# EAGLE schematic board (EAGLE 9.6.2)
CNAME: JTAG adapter board; CREVISION: V1.4
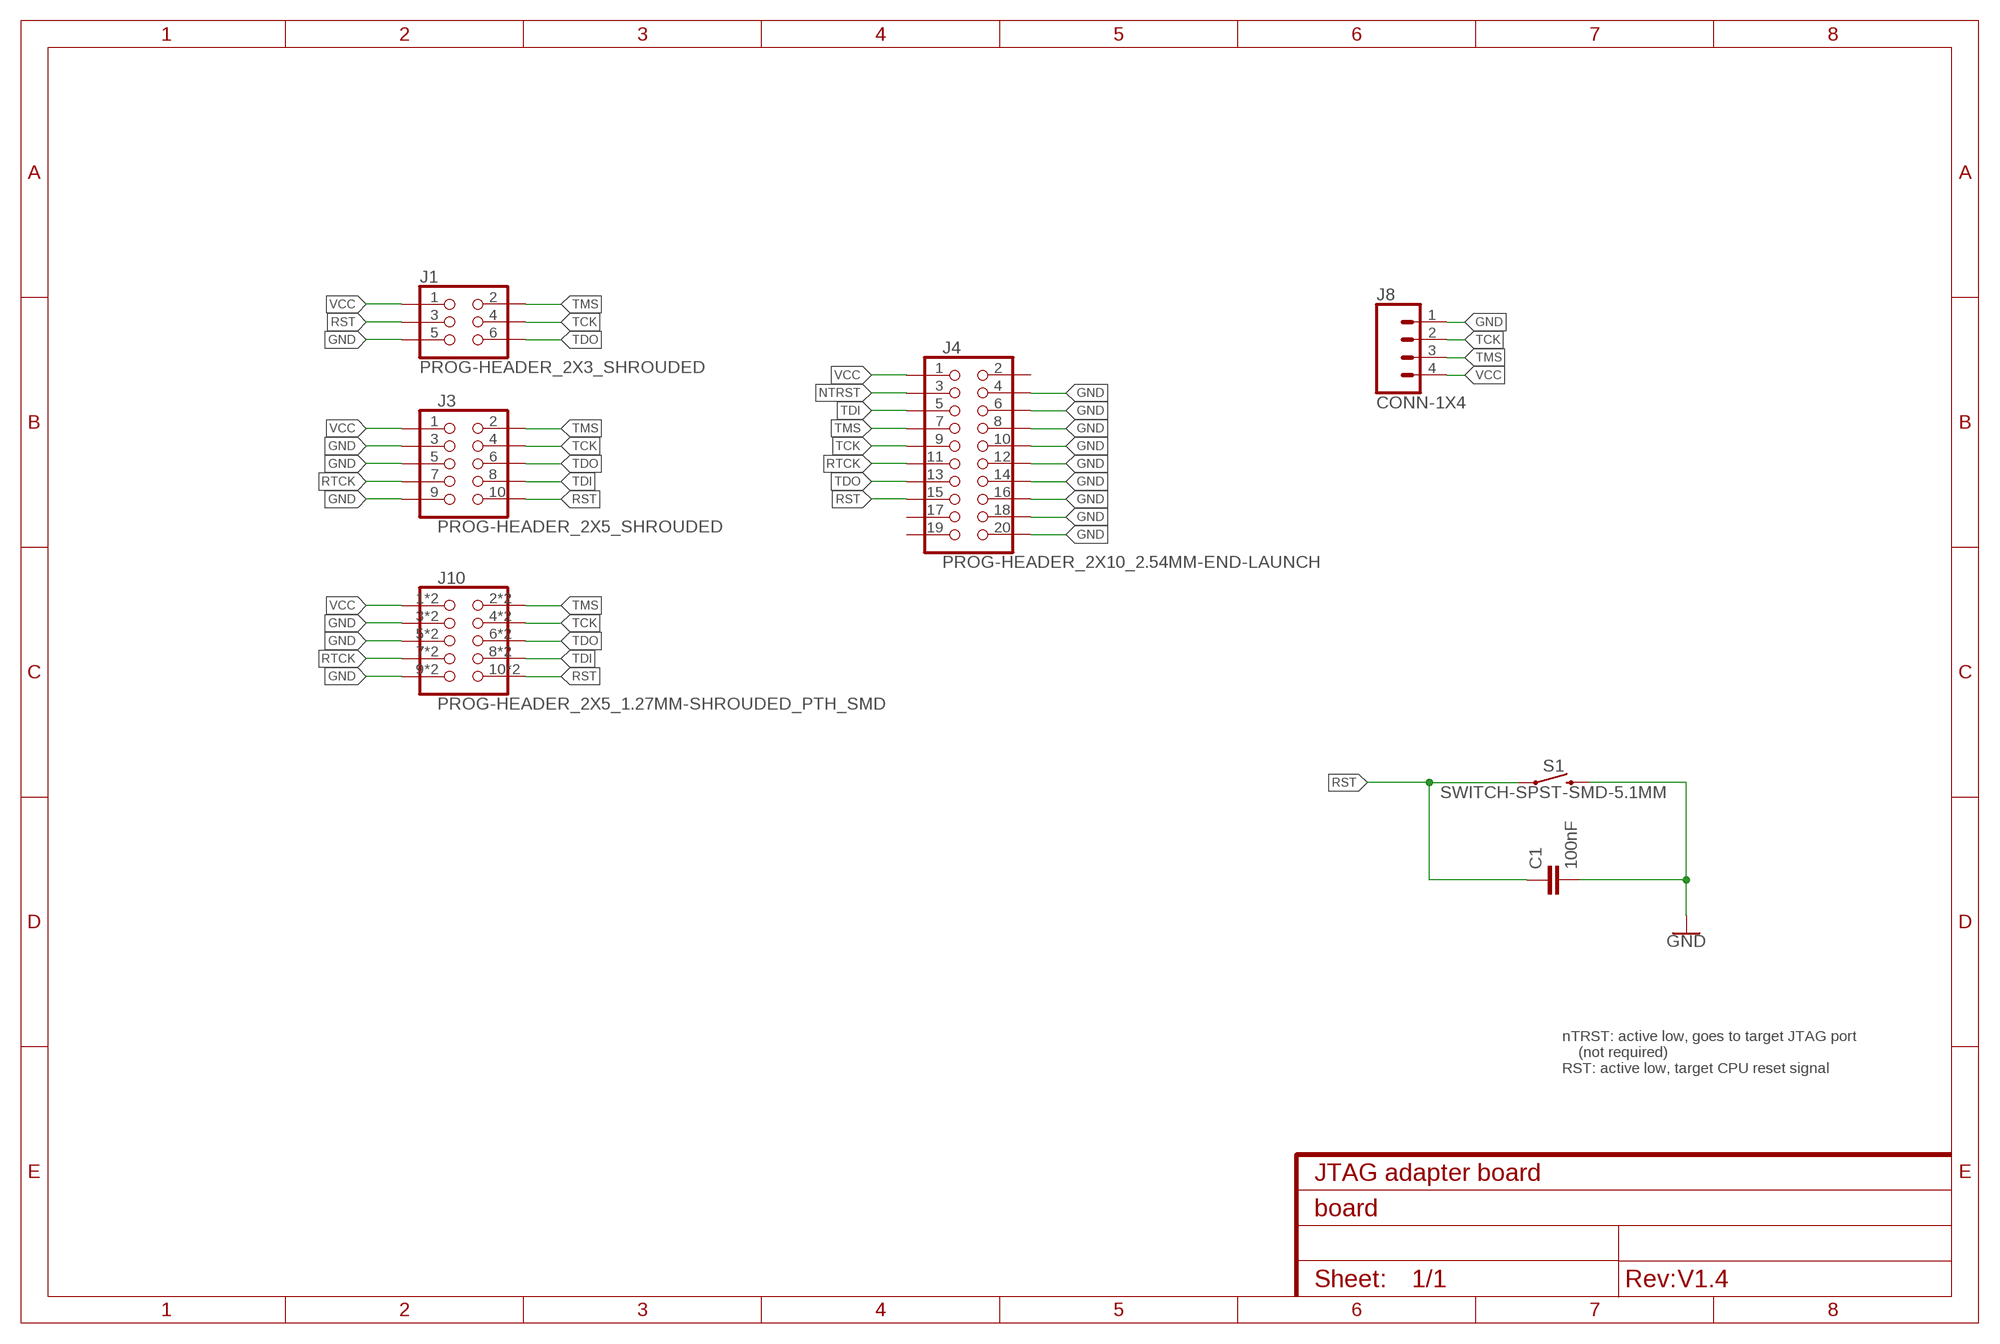
[diagram p0: schematic, sheet 1]

## Parts
C1  100nF  C-NON-POLC0603  [C0603]
J1  PROG-HEADER_2X3_SHROUDED  [2X3-2.54MM-SHROUDED]
J3  PROG-HEADER_2X5_SHROUDED  [2X5-2.54MM-SHROUDED]
J4  PROG-HEADER_2X10_2.54MM-END-LAUNCH  [2X10-2.54MM-END-LAUNCH]
J8  CONN-1X4  [XH-4P-2.54MM]
J10  PROG-HEADER_2X5_1.27MM-SHROUDED_PTH_SMD  [2X5-1.27MM-SHROUDED_PTH+SMD]
S1  SWITCH-SPST-SMD-5.1MM  [TACTILE_SWITCH_SMD_5.1MM]

## Nets
GND: C1.2 J1.5 J3.3 J3.5 J3.9 J4.4 J4.6 J4.8 J4.10 J4.12 J4.14 J4.16 J4.18 J4.20 J8.1 J10.3 J10.5 J10.9 J10.13 J10.15 J10.19 S1.3
NTRST: J4.3
RST: C1.1 J1.3 J3.10 J4.15 J10.10 J10.20 S1.1
RTCK: J3.7 J4.11 J10.7 J10.17
TCK: J1.4 J3.4 J4.9 J8.2 J10.4 J10.14
TDI: J3.8 J4.5 J10.8 J10.18
TDO: J1.6 J3.6 J4.13 J10.6 J10.16
TMS: J1.2 J3.2 J4.7 J8.3 J10.2 J10.12
VCC: J1.1 J3.1 J4.1 J8.4 J10.1 J10.11
Unconnected: J4.17 J4.19

## Notes on the sheet
- nTRST: active low, goes to target JTAG port
      (not required)
  RST: active low, target CPU reset signal

## Power pins joined to a net without a drawn wire
2: J4.2

## Library data of the parts
C1 = angrypig7-RCL:C-NON-POL; SPICEPREFIX: C
J1 = angrypig7-Connectors-Programming:PROG-HEADER_2X3
J3 = angrypig7-Connectors-Programming:PROG-HEADER_2X5; PROD_ID: CONN-08671; SF_ID: PRT-08506
J4 = angrypig7-Connectors-Programming:PROG-HEADER_2X10
J8 = angrypig7-Connectors-Programming:CONN-1X4
J10 = angrypig7-Connectors-Programming:PROG-HEADER_2X5
S1 = angrypig7-Switches:SWITCH-SPST

## Net classes
0 default: width 0.254 mm